# Altium schematic sheet 01_Linda_SRAD_Avionics_Overview.SchDoc
size A4; DrawnBy: Juan Rafael Munoz; DocumentNumber: 1; SheetNumber: 1; SheetTotal: 4
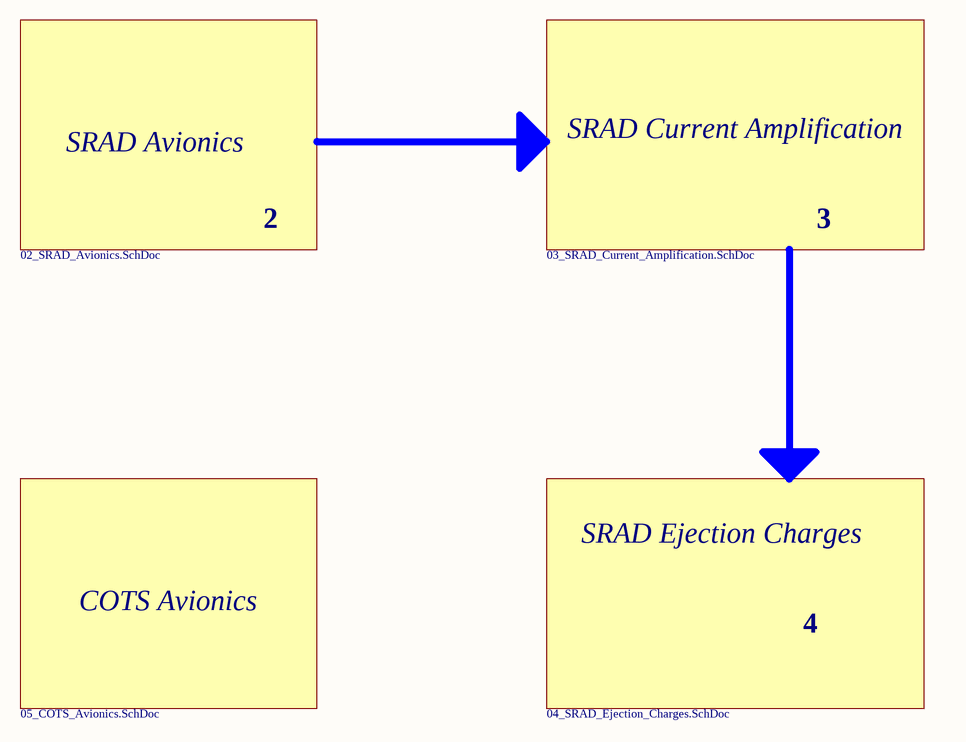
[diagram p0: 01_Linda_SRAD_Avionics_Overview.SchDoc]

## Notes on the sheet
- SRAD Avionics
- SRAD Current Amplification
- 2
- 3
- 02_SRAD_Avionics.SchDoc
- 03_SRAD_Current_Amplification.SchDoc
- SRAD Ejection Charges
- COTS Avionics
- 4
- 05_COTS_Avionics.SchDoc
- 04_SRAD_Ejection_Charges.SchDoc
- Title:
- Company:
- Date:
- Sheet
- of
- Drawn By: